# Altium schematic sheet Relay.SchDoc
size A4
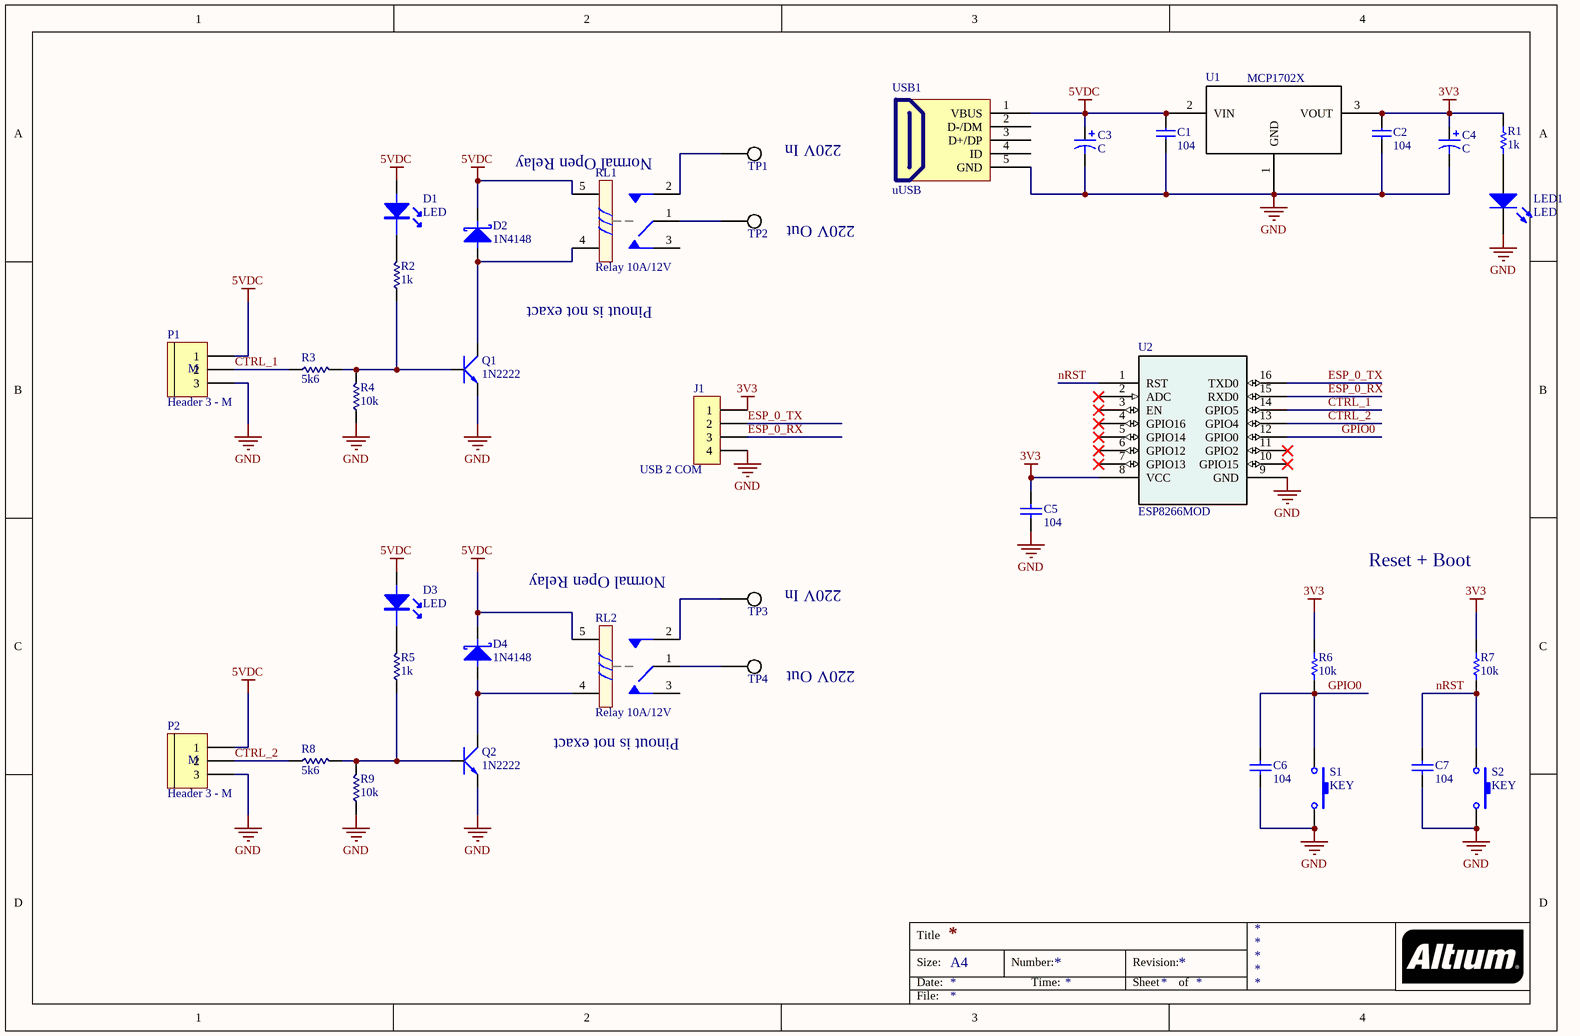
[diagram p0: Relay.SchDoc]

## Parts
C1  104  [C0603]
C2  104  [C0603]
C3  C  [3216-18]
C4  C  [3216-18]
C5  104  [C0603]
C6  104  [C0603]
C7  104  [C0603]
D1  LED  [CAP10UF]
D2  1N4148  [diode]
D3  LED  [CAP10UF]
D4  1N4148  [diode]
J1  USB 2 COM  [HDR1X4]
LED1  LED  [LED0805]
P1  Header 3 - M  [Medium - Header 3]
P2  Header 3 - M  [Medium - Header 3]
Q1  1N2222  [SOT23A]
Q2  1N2222  [SOT23A]
R1  1k  [R0603-2]
R2  1k  [R1/4W]
R3  5k6  [R1/4W]
R4  10k  [R1/4W]
R5  1k  [R1/4W]
R6  10k  [R0603-2]
R7  10k  [R0603-2]
R8  5k6  [R1/4W]
R9  10k  [R1/4W]
RL1  Relay 10A/12V  [RL_SPDT_10A]
RL2  Relay 10A/12V  [RL_SPDT_10A]
S1  KEY  [SW-SMD]
S2  KEY  [SW-SMD]
TP1  TP?  [Test Point]  (value not drawn)
TP2  TP?  [Test Point]  (value not drawn)
TP3  TP?  [Test Point]  (value not drawn)
TP4  TP?  [Test Point]  (value not drawn)
U1  MCP1702X  [SOT-89_3MC]
U2  ESP8266MOD  [ESP_7]
USB1  uUSB  [USB_MICRO_SMD]

## Nets
3V3: C2.1 C4.1 C5.1 J1.1 R1.1 R6.1 R7.1 U1.3(VOUT) U2.8(VCC)
5VDC: C1.1 C3.1 D1.1 D2.2(K) D3.1 D4.2(K) P1.1 P2.1 RL1.5 RL2.5 U1.2(VIN) USB1.1(VBUS)
GND: C1.2 C2.2 C3.2 C4.2 C5.2 C6.1 C7.1 J1.4 LED1.2(K) P1.3 P2.3 Q1.2(E) Q2.2(E) R4.1 R9.1 S1.2 S2.2 U1.1(GND) U2.9(GND) USB1.5(GND)
CTRL_1: P1.2 R3.1 U2.14(GPIO5)
CTRL_2: P2.2 R8.1 U2.13(GPIO4)
ESP_0_RX: J1.3 U2.15(RXD0)
ESP_0_TX: J1.2 U2.16(TXD0)
GPIO0: C6.2 R6.2 S1.1 U2.12(GPIO0)
nRST: C7.2 R7.2 S2.1 U2.1(RST)
NetD1_2: D1.2 R2.2
NetD2_1: D2.1(A) Q1.3(C) RL1.4
NetD3_2: D3.2 R5.2
NetD4_1: D4.1(A) Q2.3(C) RL2.4
NetLED1_1: LED1.1(A) R1.2
NetQ1_1: Q1.1(B) R2.1 R3.2 R4.2
NetQ2_1: Q2.1(B) R5.1 R8.2 R9.2
NetRL1_1: RL1.1 TP2.1
NetRL1_2: RL1.2 TP1.1
NetRL2_1: RL2.1 TP4.1
NetRL2_2: RL2.2 TP3.1

Not connected (* = marked no-connect by the designer): RL1 3; RL2 3; U2 2(ADC)* 3(EN)* 4(GPIO16)* 5(GPIO14)* 6(GPIO12)* 7(GPIO13)* 10(GPIO15)* 11(GPIO2)*; USB1 2(D-/DM) 3(D+/DP) 4(ID)

## Notes on the sheet
- (near RL1) Normal Open Relay
- (near TP1) 220V In
- (near TP2) 220V Out
- Pinout is not exact
- Normal Open Relay
- (near TP3) 220V In
- Reset + Boot
- (near TP4) 220V Out
- Title
- Size:
- Date:
- A4
- Number:
- Time:
- Revision:
- Sheet
- of
- File:
- (in symbol Header 3 - M) M

## Library data of the parts
C1 C2 = C0402-1n0: Capacitor, X7R, ±10%; Value: 1.0nF; Note: 50V; Artikkelnr Noca: 20039223; Artikkelnr Simpro: N.A.; Part Number: C0402-1n0; Manufacturer: *; Manufacturer Part Number: *; Datasheet: *; LatestRevisionDate: 2009-11-23; Pin Count: 2; Publisher: Nordic Semiconductor; Published: 2009-05-08; Supplier: *; Supplier part number: *; 2nd source Supplier: *; 2nd source part number: *; Footprint Doc: 0402
C3 C4 = CAP POL: Cap 100uF/35V - 470uF/16V; Value: 100uF/35V/50V; Description 1: 1000uF/6,3V - 470uF/16V - 330uF - 25V; Description 2: 220uF/35V - 100uF/50V - 63V - 4,7uF/200V; Description 3: 22uF => 33uF100V - 3,3uF => 4,7uF/250V; Description 4: 2,2uF =>3,3uF/350 - 2,2uF/400V - 1uF/450V
C5-C7 = Cap Ceramic: Capacitor; Published: 8-Jun-2000; LatestRevisionDate: 17-Jul-2002; LatestRevisionNote: Re-released for DXP Platform.; PackageReference: RAD-0.3; Publisher: Altium Limited; PackageDescription: Radial Cap, Thru-Hole; 2 Leads; 0.3 in Pin Spacing
D2 D4 = 1N4148: Schottky Diode
J1 = CON4: Connector
LED1 = LED: Typical INFRARED GaAs LED; Published: 8-Jun-2000; LatestRevisionDate: 08-Jul-2005; LatestRevisionNote: Mech Layer 1 removed.; PackageReference: LED-0; Publisher: Altium Limited; PackageDescription: LED; 2 Leads
P1 P2 = Header 3 - M: Header, 3-Pin, Medium; LatestRevisionDate: 17-Jul-2002; LatestRevisionNote: Re-released for DXP Platform.; Publisher: Altium Limited
Q1 Q2 = MMBT2222A: NPN switching transistor  40V 600mA SOT23; Manufacturer: Fairchild; Ic: 1000mA; Name: MMBT2222; Vce: 40V; Datasheet: http://www.farnell.com/datasheets/1842966.pdf; Footprint: SOT23
R1 R6 R7 = RES: Published: 8-Jun-2000; LatestRevisionDate: 17-Jul-2002; LatestRevisionNote: Re-released for DXP Platform.; PackageReference: AXIAL-0.3; Publisher: Altium Limited; PackageDescription: Axial Device, Thru-Hole; 2 Leads; 0.3 in Pin Spacing
R2-R5 R8 R9 = R1/4W: Resistor 1/4W; Value: Res
RL1 RL2 = Relay 1: Relay SPDT,10A - 12VDC 5 Pin; Value: Relay SPDT, 10A, 12V
S1 S2 = Button2: Button
TP1-TP4 = TP_: Test point; .Checked Sch: *; .Checked PCB: *
U1 = MCP1702X: 250 mA Low Quiescent Current LDO Regulator; RefDes: RefDes; Type: DEV; Value: Value
U2 = ESP8266MOD: ESP8266 WIFI MODULE V7; PIN_COUNT: 16; RefDes: RefDes; Type: DEV; Value: Value
USB1 = USB_M